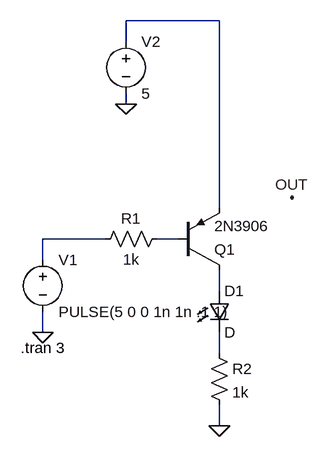
[diagram p0: schematic pnp.asc]
pnp.asc, the LTspice schematic file:
Version 4
SHEET 1 880 680
WIRE 304 -144 160 -144
WIRE 160 -112 160 -144
WIRE 160 -16 160 -32
WIRE 304 144 304 -144
WIRE 128 192 32 192
WIRE 240 192 208 192
WIRE 32 224 32 192
WIRE 304 272 304 240
WIRE 32 336 32 304
WIRE 304 368 304 336
WIRE 304 480 304 448
FLAG 32 336 0
FLAG 160 -16 0
FLAG 416 128 OUT
FLAG 304 480 0
SYMBOL pnp 240 240 M180
SYMATTR InstName Q1
SYMATTR Value 2N3906
SYMBOL res 224 176 R90
WINDOW 0 0 56 VBottom 2
WINDOW 3 32 56 VTop 2
SYMATTR InstName R1
SYMATTR Value 1k
SYMBOL res 288 352 R0
SYMATTR InstName R2
SYMATTR Value 1k
SYMBOL voltage 32 208 R0
WINDOW 123 0 0 Left 0
WINDOW 39 0 0 Left 0
SYMATTR InstName V1
SYMATTR Value PULSE(5 0 0 1n 1n .1 1)
SYMBOL voltage 160 -128 R0
WINDOW 123 0 0 Left 0
WINDOW 39 0 0 Left 0
SYMATTR InstName V2
SYMATTR Value 5
SYMBOL LED 288 272 R0
SYMATTR InstName D1
TEXT -2 360 Left 2 !.tran 3

The netlist it stands for:
* pnp.asc
Q1 N004 N003 N001 0 2N3906
R1 N003 N002 1k
R2 N005 0 1k
V1 N002 0 PULSE(5 0 0 1n 1n .1 1)
V2 N001 0 5
D1 N004 N005 D
.model D D
.lib standard.dio
.model NPN NPN
.model PNP PNP
.lib standard.bjt
.tran 3
.backanno
.end